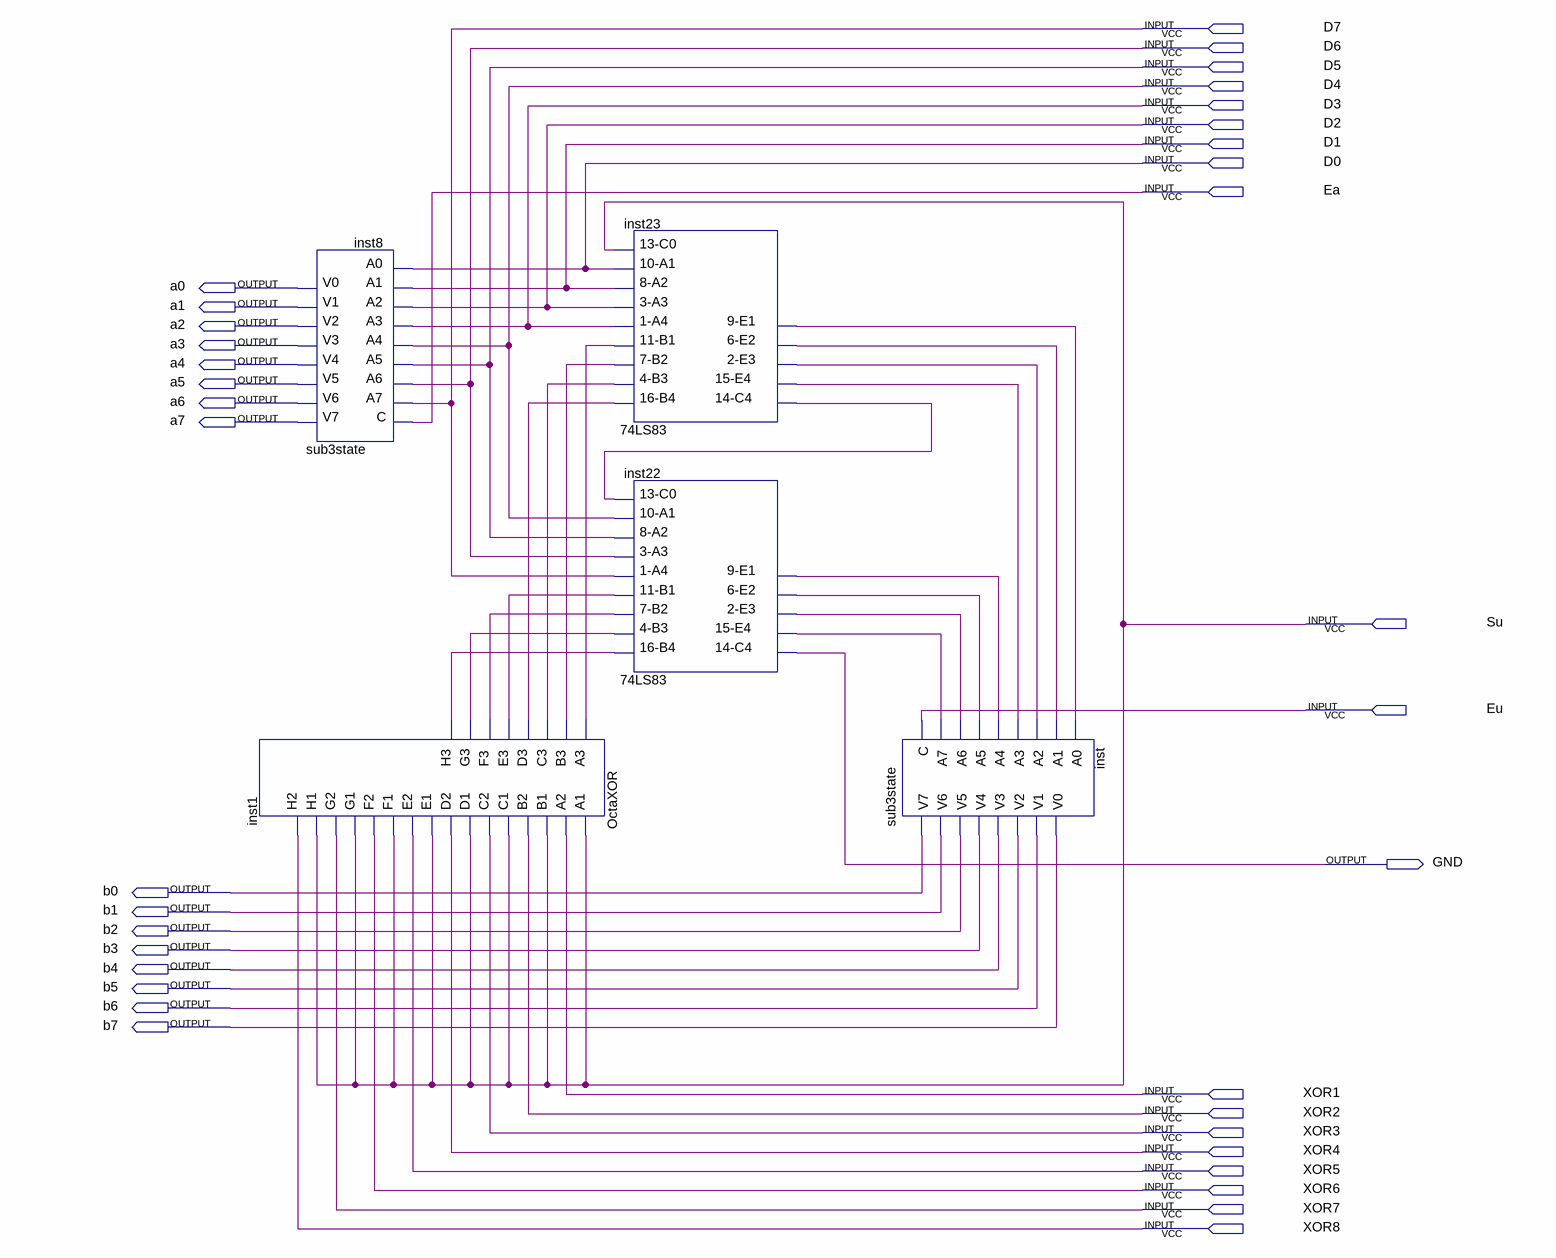
[diagram p0: schematic sheet]
// Quartus schematic SomadorSubtrator.bdf as structural Verilog: 5 symbols, 36 pins
module SomadorSubtrator (
  input  D7,
  input  D6,
  input  D5,
  input  D4,
  input  D3,
  input  D2,
  input  D1,
  input  D0,
  input  Ea,
  input  Su,
  input  Eu,
  input  XOR1,
  input  XOR2,
  input  XOR3,
  input  XOR4,
  input  XOR5,
  input  XOR6,
  input  XOR7,
  input  XOR8,
  output a0,
  output a1,
  output a2,
  output a3,
  output a4,
  output a5,
  output a6,
  output a7,
  output GND,
  output b0,
  output b1,
  output b2,
  output b3,
  output b4,
  output b5,
  output b6,
  output b7
);

  wire inst1_a3, inst1_b3, inst1_c3, inst1_d3, inst1_e3, inst1_f3, inst1_g3, inst1_h3, inst22_2_e3,
       inst22_6_e2, inst22_9_e1, inst22_15_e4, inst23_2_e3, inst23_6_e2, inst23_9_e1, inst23_14_c4,
       inst23_15_e4;

  OctaXOR inst1 (
    .A1(Su), .A2(XOR1), .B1(Su), .B2(XOR2), .C1(Su), .C2(XOR3), .D1(Su), .D2(XOR4), .E1(Su), .E2(XOR5),
    .F1(Su), .F2(XOR6), .G1(Su), .G2(XOR7), .H1(Su), .H2(XOR8), .A3(inst1_a3), .B3(inst1_b3), .C3(inst1_c3),
    .D3(inst1_d3), .E3(inst1_e3), .F3(inst1_f3), .G3(inst1_g3), .H3(inst1_h3));
  sub3state inst8 (
    .C(Ea), .A7(D7), .A6(D6), .A5(D5), .A4(D4), .A3(D3), .A2(D2), .A1(D1), .A0(D0), .V7(a7), .V6(a6),
    .V5(a5), .V4(a4), .V3(a3), .V2(a2), .V1(a1), .V0(a0));
  \74LS83  inst23 (
    .\16-B4 (inst1_d3), .\4-B3 (inst1_c3), .\7-B2 (inst1_b3), .\11-B1 (inst1_a3), .\1-A4 (D3), .\3-A3 (D2),
    .\8-A2 (D1), .\10-A1 (D0), .\13-C0 (Su), .\14-C4 (inst23_14_c4), .\15-E4 (inst23_15_e4),
    .\2-E3 (inst23_2_e3), .\6-E2 (inst23_6_e2), .\9-E1 (inst23_9_e1));
  \74LS83  inst22 (
    .\16-B4 (inst1_h3), .\4-B3 (inst1_g3), .\7-B2 (inst1_f3), .\11-B1 (inst1_e3), .\1-A4 (D7), .\3-A3 (D6),
    .\8-A2 (D5), .\10-A1 (D4), .\13-C0 (inst23_14_c4), .\14-C4 (GND), .\15-E4 (inst22_15_e4),
    .\2-E3 (inst22_2_e3), .\6-E2 (inst22_6_e2), .\9-E1 (inst22_9_e1));
  sub3state inst (
    .C(Eu), .A7(inst22_15_e4), .A6(inst22_2_e3), .A5(inst22_6_e2), .A4(inst22_9_e1), .A3(inst23_15_e4),
    .A2(inst23_2_e3), .A1(inst23_6_e2), .A0(inst23_9_e1), .V7(b0), .V6(b1), .V5(b2), .V4(b3), .V3(b4),
    .V2(b5), .V1(b6), .V0(b7));
endmodule
